# Altium schematic sheet Sheet1.SchDoc
size A
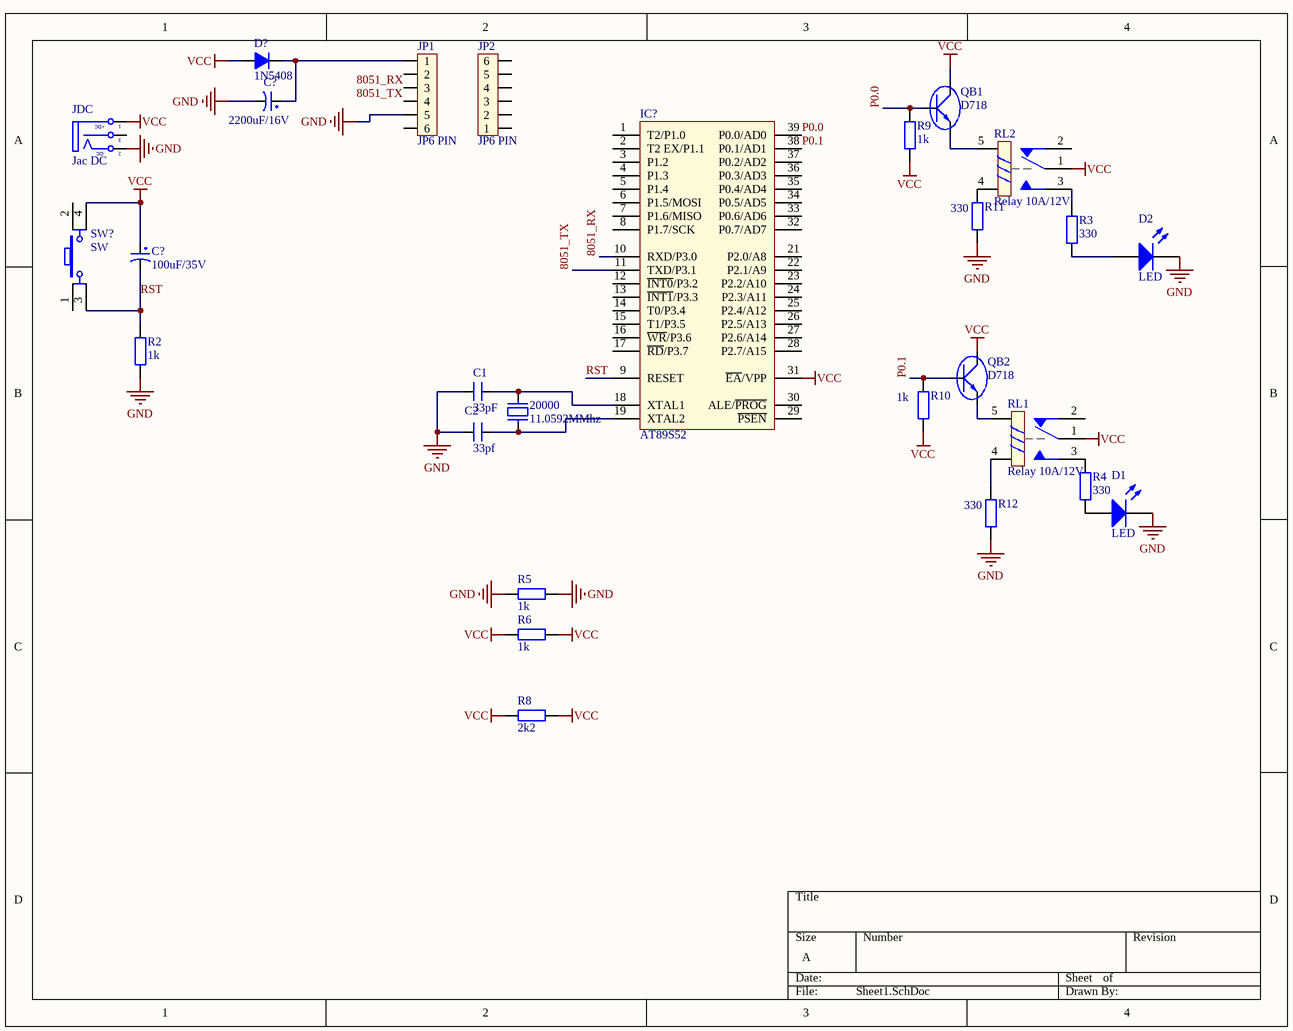
[diagram p0: Sheet1.SchDoc]

## Parts
(Parts that share a designator on the sheet are numbered #1, #2 ... from top to bottom, then left to right.)
20000  11.0592MMhz  [XT2]
C1  33pF  [CN1]
C2  33pf  [CN1]
C?#1  2200uF/16V  [CP2/4]
C?#2  100uF/35V  [CP1.5/3.4]
D1  LED  [LED-0 5mm BLUE]
D2  LED  [LED-0 5mm BLUE]
D?  1N5408  [D5A]
IC?  AT89S52  [DIP40/W0.6]
JDC  Jac DC  [DC-IN]
JP1  JP6 PIN  [JP6]
JP2  JP6 PIN  [JP6]
QB1  D718  [QTO-247]
QB2  D718  [QTO-247]
R2  1k  [R1/4W]
R3  330  [R1/4W]
R4  330  [R1/4W]
R5  1k  [R1/4W]
R6  1k  [R1/4W]
R8  2k2  [R1/4W]
R9  1k  [R1/4W]
R10  1k  [R1/4W]
R11  330  [R1/4W]
R12  330  [R1/4W]
RL1  Relay 10A/12V  [RL_SPDT_10A]
RL2  Relay 10A/12V  [RL_SPDT_10A]
SW?  SW  [SW4]

## Nets
GND: C1.1 C2.1 C?#1.2 D1.2(K) D2.2(K) IC?.20(GND) JDC.2(TN) JP1.5 R2.1 R5.1 R5.2 R11.1 R12.1
VCC: C?#2.1 D?.1(A) IC?.31(~{EA}/VPP) IC?.40(VCC) JDC.1(T) QB1.2(C) QB2.2(C) R6.1 R6.2 R8.1 R8.2 R9.1 R10.1 RL1.1 RL2.1 SW?.4
8051_RX: IC?.10(RXD/P3.0)
8051_TX: IC?.11(TXD/P3.1)
P0.0: IC?.39(P0.0/AD0) QB1.1(B) R9.2
P0.1: IC?.38(P0.1/AD1) QB2.1(B) R10.2
RST: C?#2.2 IC?.9(RESET) R2.2 SW?.3
Net20000_1: 20000.1 C1.2 IC?.18(XTAL1)
Net20000_2: 20000.2 C2.2 IC?.19(XTAL2)
NetC?#1_1: C?#1.1 D?.2(K) JP1.1
NetD1_1: D1.1(A) R4.1
NetD2_1: D2.1(A) R3.1
NetQB1_3: QB1.3(E) RL2.5
NetQB2_3: QB2.3(E) RL1.5
NetR3_2: R3.2 RL2.3
NetR4_2: R4.2 RL1.3
NetR11_2: R11.2 RL2.4
NetR12_2: R12.2 RL1.4

Not connected (* = marked no-connect by the designer): IC? 1(T2/P1.0) 2(T2_EX/P1.1) 3(P1.2) 4(P1.3) 5(P1.4) 6(P1.5/MOSI) 7(P1.6/MISO) 8(P1.7/SCK) 12(~{INT0}/P3.2) 13(~{INT1}/P3.3) 14(T0/P3.4) 15(T1/P3.5) 16(~{WR}/P3.6) 17(~{RD}/P3.7) 21(P2.0/A8) 22(P2.1/A9) 23(P2.2/A10) 24(P2.3/A11) 25(P2.4/A12) 26(P2.5/A13) 27(P2.6/A14) 28(P2.7/A15) 29(~{PSEN}) 30(ALE/~{PROG}) 32(P0.7/AD7) 33(P0.6/AD6) 34(P0.5/AD5) 35(P0.4/AD4) 36(P0.3/AD3) 37(P0.2/AD2); JDC 3(S); JP1 2 3 4 6; JP2 1 2 3 4 5 6; RL1 2; RL2 2; SW? 1 2

## Notes on the sheet
- Labels drawn without touching a wire or pin: 8051_RX, 8051_TX
- (in symbol DCIN) +DC; -DC

## Library data of the parts
20000 = XT2: Crystal For all Crystal 2pin.; Value: 4Mhz
C1 C2 = CN1: Cap np  1pF - 472pF; Value: 100pF
C?#1 = CP5: Cap 2200uF/16V - 1000uF/50V; Description 5: 47uF/200V - 22uF/350V - 400V - 10uF/450V; Description 1: 4700uF-6800uF/6,3V - 3300uF-4700uF/10V; Description 2: 2200uF-3300uF/16V - 470uF => 2200uF/25V; Description 3: 1000uF/35V-50V_470uF/63V_220uF>330uF/100V; Description 4: 47uF => 100uF/160V - 33uF-47uF/250V; Value: 2200uF/16V
C?#2 = CP3: Cap 100uF/35V - 470uF/16V; Value: 100uF/35V/50V; Description 1: 1000uF/6,3V - 470uF/16V - 330uF - 25V; Description 2: 220uF/35V - 100uF/50V - 63V - 4,7uF/200V; Description 3: 22uF => 33uF100V - 3,3uF => 4,7uF/250V; Description 4: 2,2uF =>3,3uF/350 - 2,2uF/400V - 1uF/450V
D1 D2 = LED: Typical LED; Published: 8-Jun-2000; LatestRevisionDate: 08-Jul-2005; LatestRevisionNote: Mech Layer 1 removed.; PackageReference: LED-1; Publisher: Altium Limited
D? = D5A: Diode 5A; Value: 1N5408
IC? = AT89S52: AT89S52, 8k Byte Flash Memory , 40 Pin; Value: AT89S52
JDC = DCIN: Jac DC input; Value: Jac DC
JP1 JP2 = JP6: Value: JP7
QB1 QB2 = D718: Transistor Power Supply; Value: D718
R2-R6 R8-R12 = R1/4W: Resistor 1/4W; Value: R1/4W - 1K
RL1 RL2 = Relay 1: Relay SPDT,10A - 12VDC 5 Pin; Value: Relay SPDT, 10A, 12V
SW? = SW4: Switch button 4 pin; Value: Button chip 4 pin